# EAGLE design Linear-Temperature-Controller (EAGLE 6.5.0)

## Sheet 1 of 2
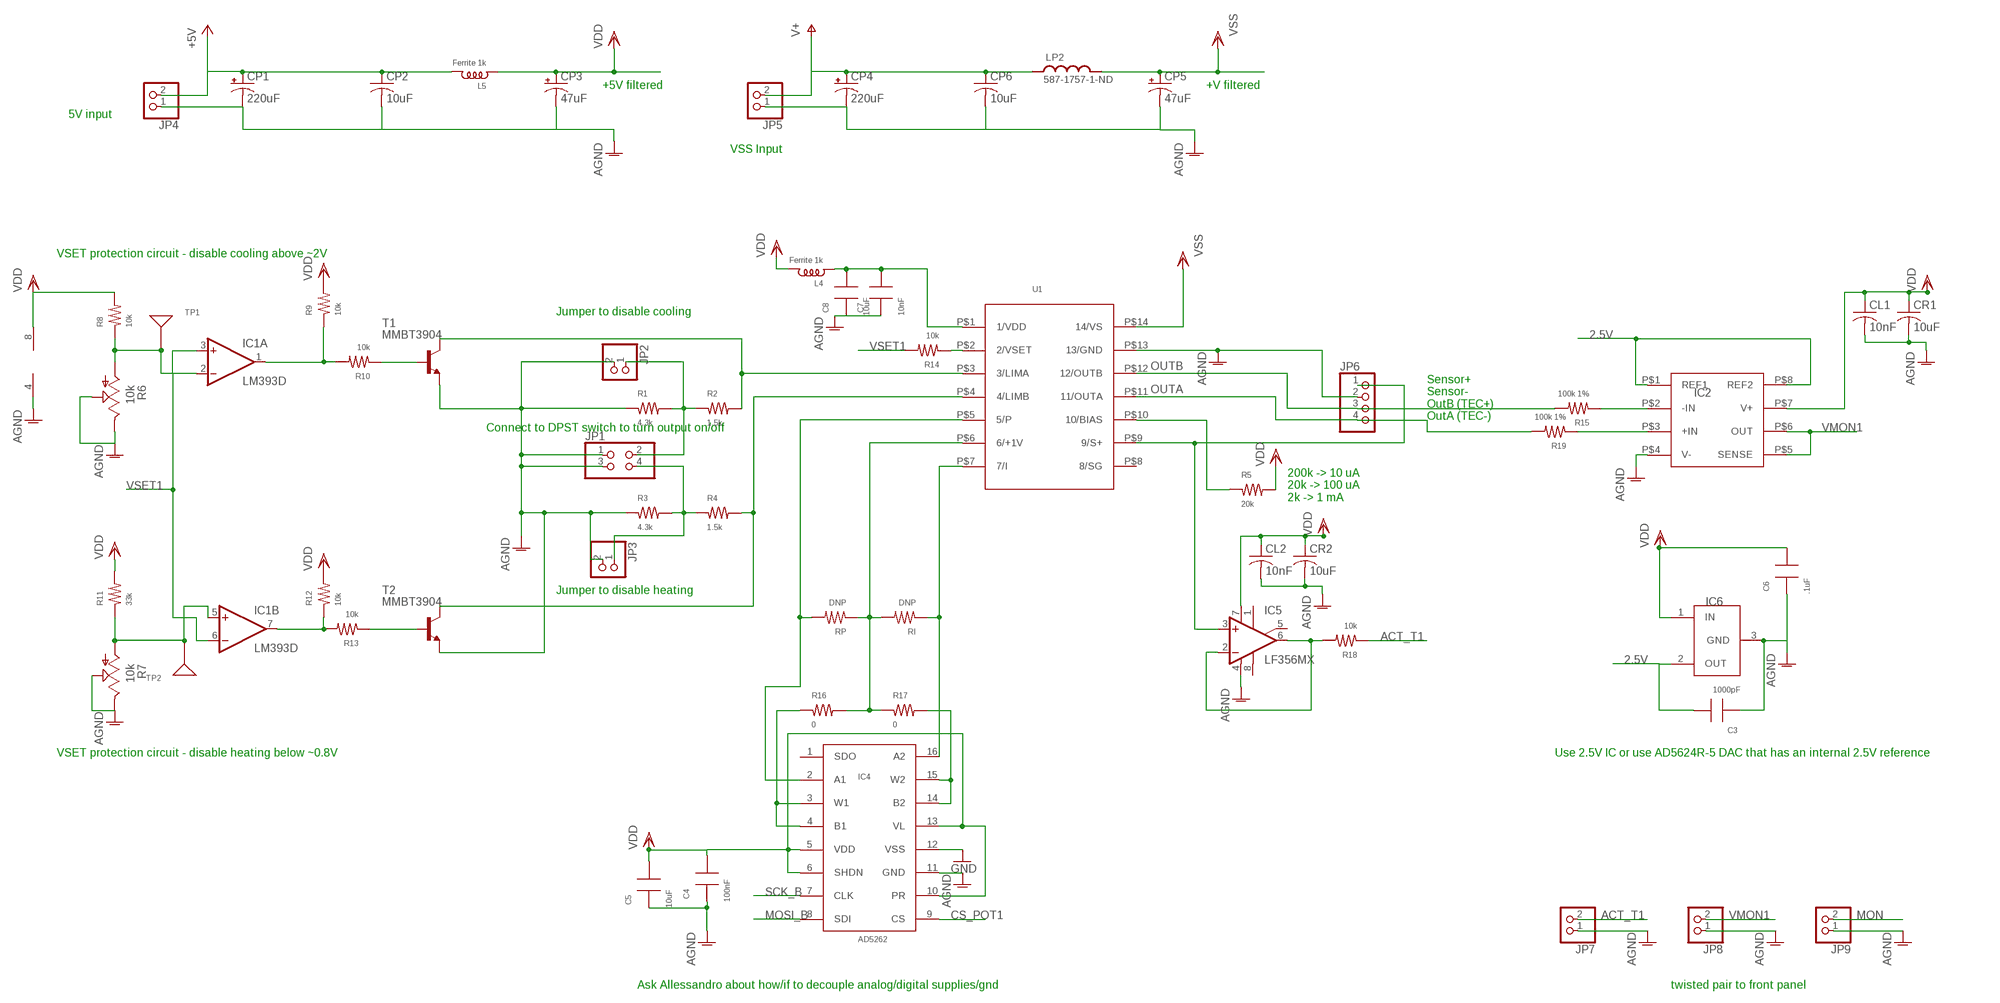
[diagram p0: schematic, sheet 1]

### Parts
C3  1000pF  CAP0805  [0805]
C4  100nF  CAP0805  [0805]
C5  10uF  CAP0805  [0805]
C6  .1uF  CAP0805  [0805]
C7  10nF  CAP0805  [0805]
C8  10uF  CAP0805  [0805]
CL1  10nF  C-USC0805  [C0805]
CL2  10nF  C-USC0805  [C0805]
CP1  220uF  CPOL-USF  [PANASONIC_F]
CP2  10uF  C-USC0805K  [C0805K]
CP3  47uF  CPOL-USCT7343  [CT7343]
CP4  220uF  CPOL-USF  [PANASONIC_F]
CP5  47uF  CPOL-USCT7343  [CT7343]
CP6  10uF  C-USC0805K  [C0805K]
CR1  10uF  C-USC0805  [C0805]
CR2  10uF  C-USC0805  [C0805]
IC1  LM393D  [SO08]
IC2  INA159  [VSSOP8]
IC4  AD5262  [TSSOP16]
IC5  LF356MX  OPAMP-SO  [SO08]
IC6  TS6001  [SOT-23]
JP1  PINHD-2X2  [2X02]
JP2  PINHD-1X2  [1X02]
JP3  PINHD-1X2  [1X02]
JP4  PINHD-1X2  [1X02]
JP5  PINHD-1X2  [1X02]
JP6  PINHD-1X4  [1X04]
JP7  PINHD-1X2  [1X02]
JP8  PINHD-1X2  [1X02]
JP9  PINHD-1X2  [1X02]
L4  Ferrite 1k  INDUCTOR-0805  [0805]
L5  Ferrite 1k  INDUCTOR-0805  [0805]
LP2  587-1757-1-ND  L_FERRITE_SMD  [L_FERRITE_1810]
R1  4.3k  RES0805  [0805]
R2  1.5k  RES0805  [0805]
R3  4.3k  RES0805  [0805]
R4  1.5k  RES0805  [0805]
R5  20k  RES0805  [0805]
R6  10k  64XR  [64XPOT]
R7  10k  64XR  [64XPOT]
R8  10k  RES0805  [0805]
R9  10k  RES0805  [0805]
R10  10k  RES0805  [0805]
R11  33k  RES0805  [0805]
R12  10k  RES0805  [0805]
R13  10k  RES0805  [0805]
R14  10k  RES0805  [0805]
R15  100k 1%  RES1206  [1206]
R16  0  RES0805  [0805]
R17  0  RES0805  [0805]
R18  10k  RES0805  [0805]
R19  100k 1%  RES1206  [1206]
RI  DNP  RES0805  [0805]
RP  DNP  RES0805  [0805]
T1  MMBT3904  [SOT-23]
T2  MMBT3904  [SOT-23]
TP1  TESTPT  [1206TESTPAD]
TP2  TESTPT  [1206TESTPAD]
U1  WTC3243  [WTC3293]

### Nets
2.5V: C3.2 IC2.P$1(REF1) IC2.P$8(REF2) IC6.2(OUT) ; also sheet 2
+5V: CP1.+ CP2.1 JP4.2 L5.2
ACT_T1: JP7.2 R18.1 ; also sheet 2
AGND: C3.1 C4.1 C5.1 C6.1 C7.1 C8.1 CL1.2 CL2.2 CP1.- CP2.2 CP3.- CP4.- CP5.- CP6.2 CR1.2 CR2.2 IC1.4(P:V-) IC2.P$4(V-) IC4.11(GND) IC5.4(V-) IC6.3(GND) JP1.1 JP1.3 JP2.2 JP3.2 JP4.1 JP5.1 JP6.2 JP7.1 JP8.1 JP9.1 R1.1 R3.1 R6.P$2 R6.P$3 R7.P$2 R7.P$3 T1.2(E) T2.2(E) U1.P$13(13/GND) ; also sheet 2
CS_POT1: IC4.9(CS) ; also sheet 2
DGND: IC4.12(VSS) ; supply symbol labelled GND ; also sheet 2
MON: JP9.2 ; also sheet 2
MOSI_B: IC4.8(SDI) ; also sheet 2
N$1: R2.2 T1.3(C) U1.P$3(3/LIMA)
N$2: JP1.2 JP2.1 R1.2 R2.1
N$3: R4.2 T2.3(C) U1.P$4(4/LIMB)
N$4: JP1.4 JP3.1 R3.2 R4.1
N$5: R5.1 U1.P$10(10/BIAS)
N$6: IC1.2(A:-IN) R6.P$1 R8.1 TP1.P$1
N$7: IC1.5(B:+IN) R7.P$1 R11.1 TP2.P$1
N$8: IC1.7(B:OUT) R12.1 R13.2
N$9: IC1.1(A:OUT) R9.1 R10.2
N$10: R10.1 T1.1(B)
N$11: R13.1 T2.1(B)
N$12: R14.1 U1.P$2(2/VSET)
N$13: IC5.3(+IN) JP6.1 U1.P$9(9/S+)
N$14: IC2.P$2(-IN) R15.1
N$15: IC4.2(A1) RP.2 U1.P$5(5/P)
N$16: IC2.P$3(+IN) R19.1
N$17: R16.2 R17.1 RI.2 RP.1 U1.P$6(6/+1V)
N$18: IC4.3(W1) IC4.4(B1) R16.1
N$19: IC4.16(A2) RI.1 U1.P$7(7/I)
N$20: IC4.14(B2) IC4.15(W2) R17.2
N$23: IC5.2(-IN) IC5.6(OUT) R18.2
N$26: C7.2 C8.2 L4.1 U1.P$1(1/VDD)
OUTA: JP6.4 R19.2 U1.P$11(11/OUTA)
OUTB: JP6.3 R15.2 U1.P$12(12/OUTB)
SCK_B: IC4.7(CLK) ; also sheet 2
V+: CP4.+ CP6.1 JP5.2 LP2.P$1
VDD: C4.2 C5.2 C6.2 CL1.1 CL2.1 CP3.+ CR1.1 CR2.1 IC1.8(P:V+) IC2.P$7(V+) IC4.5(VDD) IC4.6(SHDN) IC4.10(PR) IC4.13(VL) IC5.7(V+) IC6.1(IN) L4.2 L5.1 R5.2 R8.2 R9.2 R11.2 R12.2 ; also sheet 2
VMON1: IC2.P$5(SENSE) IC2.P$6(OUT) JP8.2 ; also sheet 2
VSET1: IC1.3(A:+IN) IC1.6(B:-IN) R14.2 ; also sheet 2
VSS: CP5.+ LP2.P$2 U1.P$14(14/VS)
Unconnected: IC4.1(SDO) IC5.1(ON1) IC5.5(ON2) IC5.8(OPT) U1.P$8(8/SG)

### Notes on the sheet
- +5V filtered | +V filtered
- 5V input
- VSS Input
- VSET protection circuit - disable cooling above ~2V
- Jumper to disable cooling
- Sensor+
  Sensor-
  OutB (TEC+)
  OutA (TEC-)
- Connect to DPST switch to turn output on/off
- 200k -> 10 uA
  20k -> 100 uA
  2k -> 1 mA
- Jumper to disable heating
- VSET protection circuit - disable heating below ~0.8V | Use 2.5V IC or use AD5624R-5 DAC that has an internal 2.5V reference
- Ask Allessandro about how/if to decouple analog/digital supplies/gnd | twisted pair to front panel

## Sheet 2 of 2
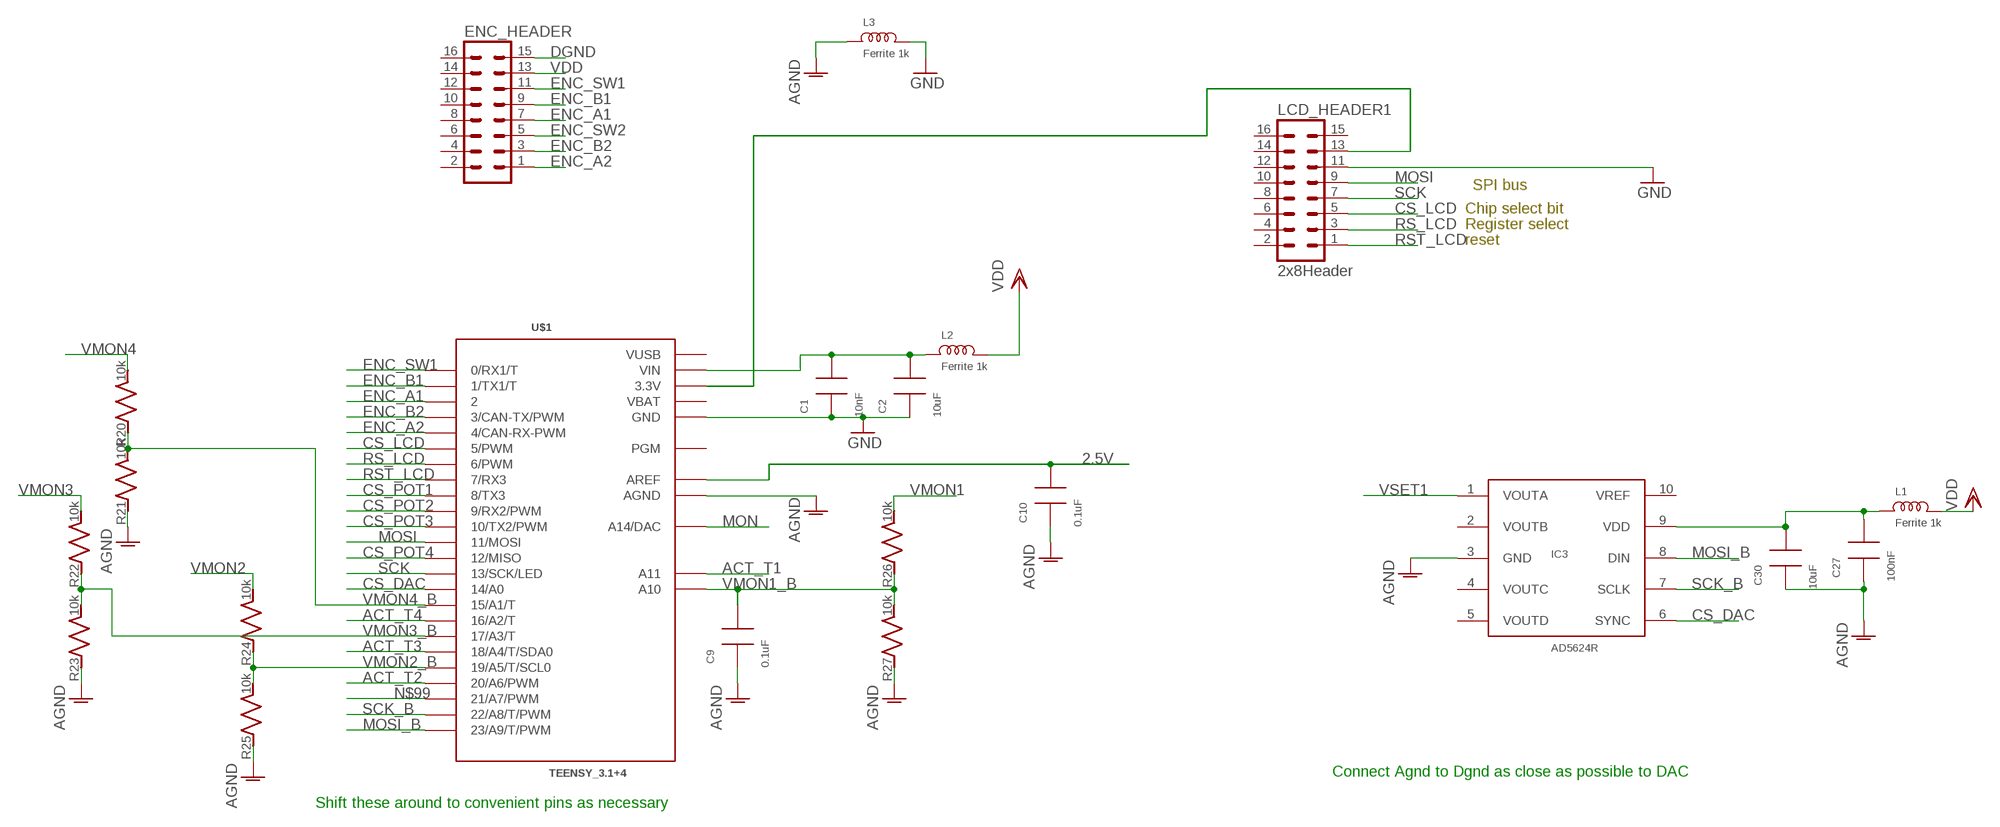
[diagram p1: schematic, sheet 2]

### Parts
C1  10nF  CAP0805  [0805]
C2  10uF  CAP0805  [0805]
C9  0.1uF  CAP0805  [0805]
C10  0.1uF  CAP0805  [0805]
C27  100nF  CAP0805  [0805]
C30  10uF  CAP0805  [0805]
ENC_HEADER  ML16  [ML16]
IC3  AD5624R  [MSOP10]
L1  Ferrite 1k  INDUCTOR-0805  [0805]
L2  Ferrite 1k  INDUCTOR-0805  [0805]
L3  Ferrite 1k  INDUCTOR-0805  [0805]
LCD_HEADER1  2x8Header  ML16  [ML16]
R20  10k  R_SMDR0805  [R_0805]
R21  10k  R_SMDR0805  [R_0805]
R22  10k  R_SMDR0805  [R_0805]
R23  10k  R_SMDR0805  [R_0805]
R24  10k  R_SMDR0805  [R_0805]
R25  10k  R_SMDR0805  [R_0805]
R26  10k  R_SMDR1206  [R_1206]
R27  10k  R_SMDR1206  [R_1206]
U$1  TEENSY_3.1+4  [TEENSY_3.1+4]

### Nets
2.5V: C10.2 U$1.AREF ; also sheet 1
ACT_T1: U$1.A11 ; also sheet 1
ACT_T2: U$1.20/A6(20/A6/PWM)
ACT_T3: U$1.18/A4(18/A4/T/SDA0)
ACT_T4: U$1.16/A2(16/A2/T)
AGND: C9.1 C10.1 C27.1 C30.1 IC3.3(GND) L3.1 R21.P$1 R23.P$1 R25.P$1 R27.P$1 U$1.AGND ; also sheet 1
CS_DAC: IC3.6(SYNC) U$1.14/A0
CS_LCD: LCD_HEADER1.5 U$1.5(5/PWM)
CS_POT1: U$1.8(8/TX3) ; also sheet 1
CS_POT2: U$1.9(9/RX2/PWM)
CS_POT3: U$1.10(10/TX2/PWM)
CS_POT4: U$1.12(12/MISO)
DGND: C1.1 C2.1 ENC_HEADER.15 L3.2 LCD_HEADER1.11 U$1.GND U$1.GND1(GND) ; supply symbol labelled GND ; also sheet 1
ENC_A1: ENC_HEADER.7 U$1.2
ENC_A2: ENC_HEADER.1 U$1.4(4/CAN-RX-PWM)
ENC_B1: ENC_HEADER.9 U$1.1(1/TX1/T)
ENC_B2: ENC_HEADER.3 U$1.3(3/CAN-TX/PWM)
ENC_SW1: ENC_HEADER.11 U$1.0(0/RX1/T)
ENC_SW2: ENC_HEADER.5
MON: U$1.A14(A14/DAC) ; also sheet 1
MOSI: LCD_HEADER1.9 U$1.11(11/MOSI)
MOSI_B: IC3.8(DIN) U$1.23/A9(23/A9/T/PWM) ; also sheet 1
N$21: LCD_HEADER1.13 U$1.3.3V U$1.3.3V1(3.3V)
N$24: C27.2 C30.2 IC3.9(VDD) L1.1
N$25: C1.2 C2.2 L2.1 U$1.VIN
N$99: U$1.21/A7(21/A7/PWM)
RS_LCD: LCD_HEADER1.3 U$1.6(6/PWM)
RST_LCD: LCD_HEADER1.1 U$1.7(7/RX3)
SCK: LCD_HEADER1.7 U$1.13(13/SCK/LED)
SCK_B: IC3.7(SCLK) U$1.22/A8(22/A8/T/PWM) ; also sheet 1
VDD: ENC_HEADER.13 L1.2 L2.2 ; also sheet 1
VMON1: R26.P$2 ; also sheet 1
VMON1_B: C9.2 R26.P$1 R27.P$2 U$1.A10
VMON2: R24.P$2
VMON2_B: R24.P$1 R25.P$2 U$1.19/A5(19/A5/T/SCL0)
VMON3: R22.P$2
VMON3_B: R22.P$1 R23.P$2 U$1.17/A3(17/A3/T)
VMON4: R20.P$2
VMON4_B: R20.P$1 R21.P$2 U$1.15/A1(15/A1/T)
VSET1: IC3.1(VOUTA) ; also sheet 1
Unconnected: ENC_HEADER.2 ENC_HEADER.4 ENC_HEADER.6 ENC_HEADER.8 ENC_HEADER.10 ENC_HEADER.12 ENC_HEADER.14 ENC_HEADER.16 IC3.2(VOUTB) IC3.4(VOUTC) IC3.5(VOUTD) IC3.10(VREF) LCD_HEADER1.2 LCD_HEADER1.4 LCD_HEADER1.6 LCD_HEADER1.8 LCD_HEADER1.10 LCD_HEADER1.12 LCD_HEADER1.14 LCD_HEADER1.15 LCD_HEADER1.16 U$1.PGM

### Notes on the sheet
- SPI bus
- Chip select bit
- Register select
- reset
- Connect Agnd to Dgnd as close as possible to DAC
- Shift these around to convenient pins as necessary

## Power pins joined to a net without a drawn wire
VBAT: U$1.VBAT
VUSB: U$1.VUSB

## Library data of the parts
C1-C10 C27 C30 = rlc-jqi:CAP: SMT Capacitor
CL1 CL2 CP2 CP6 CR1 CR2 = rcl:C-US: CAPACITOR, American symbol
CP1 CP3-CP5 = rcl:CPOL-US: POLARIZED CAPACITOR, American symbol
ENC_HEADER = aom_driver:ML16: HARTING 2x8 (16 pin) ribbon connector.; OC_FARNELL: unknown; OC_NEWARK: unknown
IC1 = Lin-Temp-Controller:LM393: COMPARATOR
IC2 = Lin-Temp-Controller:INA159: INA159 Difference Amplifier, Texas Instruments; DIGIKEY: 296-18688-1-ND
IC3 = Lin-Temp-Controller:AD5624R: AD5624R Quad Output DAC w/internal Vref; DIGIKEY: AD5624RBRMZ-3-ND
IC4 = Lin-Temp-Controller:AD5262: AD5262 dual circuit digital pot
IC5 = opamp-jqi:OPAMP: Basic Op Amp. Be sure to check actual pinout of your device, and modify as necessary!
IC6 = Lin-Temp-Controller:TS6001: 2.5V Reference IC; DIGIKEY: TS6001BIG325TCT-ND
JP1 = pinhead:PINHD-2X2: PIN HEADER
JP2-JP5 JP7-JP9 = pinhead:PINHD-1X2: PIN HEADER
JP6 = pinhead:PINHD-1X4: PIN HEADER
L1-L5 = rlc-jqi:INDUCTOR: SMT Inductor.
LCD_HEADER1 = mcu-accessories:ML16: HARTING 2x8 (16 pin) ribbon connector.; OC_FARNELL: unknown; OC_NEWARK: unknown; PARTNO: S9171-ND
LP2 = jqi_passives:L_FERRITE_SMD
R1-R5 R8-R19 RI RP = rlc-jqi:RES: SMT Resistor
R6 R7 = Lin-Temp-Controller:64XR; DIGIKEY: 987-1068-ND
R20-R27 = jqi_passives:R_SMD
T1 T2 = Lin-Temp-Controller:MMBT3904: NPN TRANSISTOR
TP1 TP2 = Lin-Temp-Controller:TESTPT
U1 = Lin-Temp-Controller:WTC3243
U$1 = mcu-accessories:TEENSY_3.1+4: Footprint for Teensy 3.1 board using all through-holes, i.e. the entire perimeter plus the 4 through-holes inboard (A10,A11,AREF, VUSB)

## Board
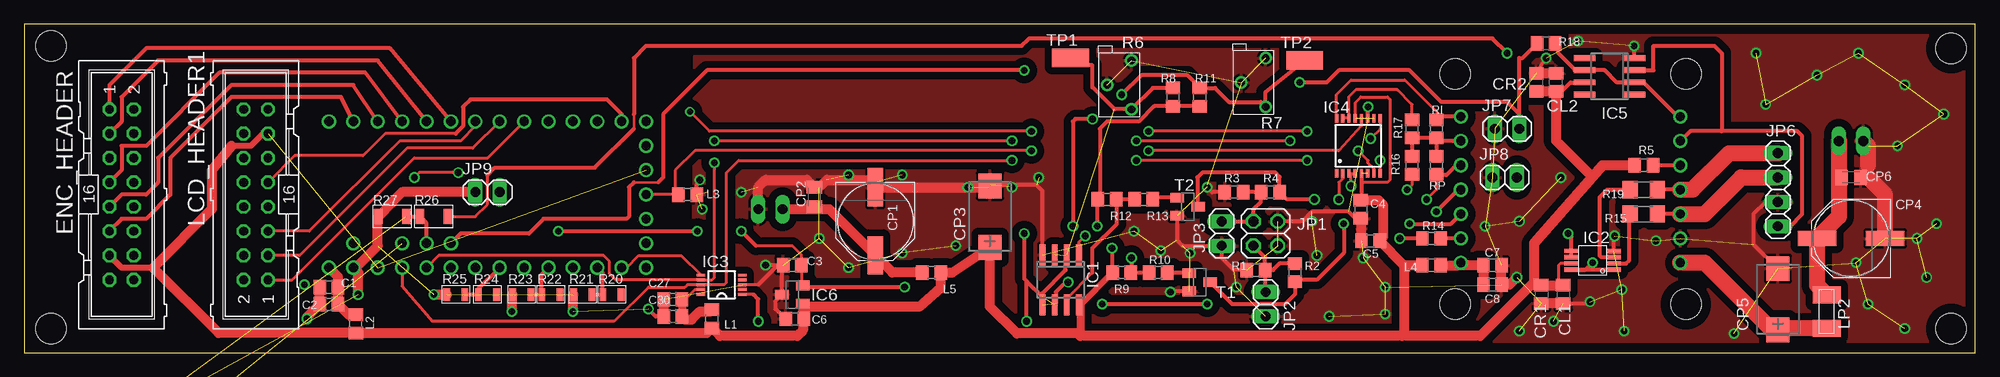
[diagram p2: board, top side]
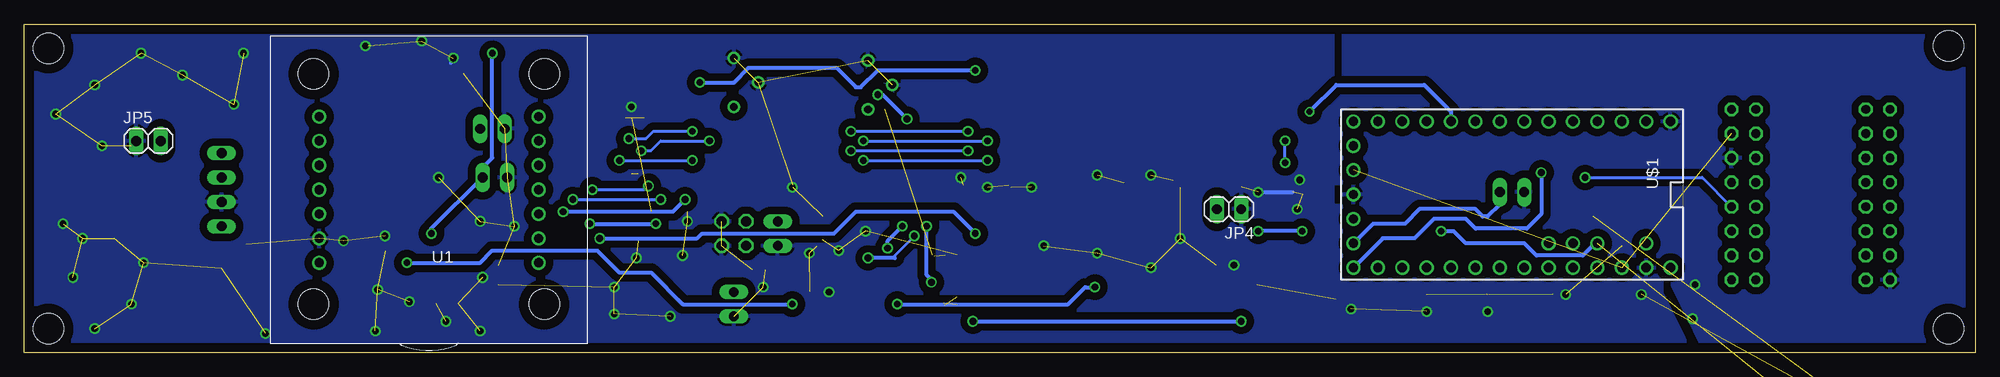
[diagram p3: board, bottom side, seen from below]

Size 203.2 x 34.29 mm. Coordinates in mm from the lower left corner, seen from the top.
Outline: 0,0 203.2,0 203.2,34.29 0,34.29 0,0
Copper layers (1*16): Top 0.035mm / dielectric 1.5mm / Bottom 0.035mm
Design rules "default": minimum track width 10mil, minimum drill 24mil, track to track 8mil, track to pad 8mil, pad to pad 8mil, via to via 8mil, smd to smd 8mil, copper to edge 40mil, drill to drill 8mil, minimum pad ring 10mil, minimum via ring 8mil, stop-mask expansion 4mil, vias tented up to drill 0mil, thermal gap 10mil
Holes 3.17 mm at 200.66,31.75 200.66,2.54 2.79,32 2.79,2.54

### Footprints (pad centres in the part's own frame; a part is rotated, then mirrored left to right if it is on the bottom)
0805 = smd 1.3 x 1.5: 1 -0.95,0; 2 0.95,0
C0805 = smd 1.3 x 1.5: 1 -0.95,0; 2 0.95,0
PANASONIC_F = smd 4 x 1.6: + 3.55,0; - -3.55,0
C0805K = smd 1.3 x 1.6: 1 -1,0; 2 1,0
CT7343 = smd 2.6 x 2.4: + -3.2,0; - 3.2,0
ML16 = drill 0.914 octagon: 1 -8.89,-1.27; 2 -8.89,1.27; 3 -6.35,-1.27; 4 -6.35,1.27; 5 -3.81,-1.27; 6 -3.81,1.27; 7 -1.27,-1.27; 8 -1.27,1.27; 9 1.27,-1.27; 10 1.27,1.27; 11 3.81,-1.27; 12 3.81,1.27; 13 6.35,-1.27; 14 6.35,1.27; 15 8.89,-1.27; 16 8.89,1.27
SO08 = smd 0.6 x 2.2: 1 -1.905,-2.6; 2 -0.635,-2.6; 3 0.635,-2.6; 4 1.905,-2.6; 5 1.905,2.6; 6 0.635,2.6; 7 -0.635,2.6; 8 -1.905,2.6
VSSOP8 = smd 0.45 x 1.45: P$1 -0.975,-2.2; P$2 -0.325,-2.2; P$3 0.325,-2.2; P$4 0.972,-2.2; P$5 0.975,2.2; P$6 0.325,2.2; P$7 -0.325,2.2; P$8 -0.975,2.2
MSOP10 = smd 0.9 x 0.3: 1 -2.16,1; 2 -2.16,0.5; 3 -2.16,0; 4 -2.16,-0.5; 5 -2.16,-1; 6 2.16,-1; 7 2.16,-0.5; 8 2.16,0; 9 2.16,0.5; 10 2.16,1
TSSOP16 = smd 0.9 x 0.35: 1 -2.875,2.275; 2 -2.875,1.625; 3 -2.875,0.975; 4 -2.875,0.325; 5 -2.875,-0.325; 6 -2.875,-0.975; 7 -2.875,-1.625; 8 -2.875,-2.275; 9 2.875,-2.275; 10 2.875,-1.625; 11 2.875,-0.975; 12 2.875,-0.325; 13 2.875,0.325; 14 2.875,0.975; 15 2.875,1.625; 16 2.875,2.275
SO08' = smd 2.2 x 0.6: 1 -2.6,1.27; 2 -2.6,0; 3 -2.6,-1.27; 4 -2.6,-2.54; 5 2.6,-2.54; 6 2.6,-1.27; 7 2.6,0; 8 2.6,1.27
SOT-23 = smd 1 x 1.4: 1 -0.95,-1.1; 2 0.95,-1.1; 3 0,1.1
2X02 = drill 1.016 octagon: 1 -1.27,-1.27; 2 -1.27,1.27; 3 1.27,-1.27; 4 1.27,1.27
1X02 = drill 1.016 long: 1 -1.27,0; 2 1.27,0
1X04 = drill 1.016 long: 1 -3.81,0; 2 -1.27,0; 3 1.27,0; 4 3.81,0
L_FERRITE_1810 = smd 1.75 x 2.9: P$1 -1.75,0; P$2 1.75,0
64XPOT = drill 0.8: P$1 -1.27,2.54; P$2 1.27,0; P$3 -1.27,-2.54
1206 = smd 1.6 x 1.803: 1 -1.422,0; 2 1.422,0
R_0805 = smd 0.7 x 1.3: P$1 -0.95,0; P$2 0.95,0
R_1206 = smd 0.9 x 1.6: P$1 -1.45,0; P$2 1.45,0
1206TESTPAD = smd 3.81 x 1.93: P$1 0,0
WTC3293 = drill 0.965: P$1 -11.43,7.62; P$2 -11.43,5.08; P$3 -11.43,2.54; P$4 -11.43,0; P$5 -11.43,-2.54; P$6 -11.43,-5.08; P$7 -11.43,-7.62; P$8 11.43,-7.62; P$9 11.43,-5.08; P$10 11.43,-2.54; P$11 11.43,0; P$12 11.43,2.54; P$13 11.43,5.08; P$14 11.43,7.62 | hole 3.175: -12.014,11.938; 12.014,11.938; 12.014,-12.065; -12.014,-12.065
TEENSY_3.1+4 = drill 0.965: 0 -7.62,15.24; 1 -7.62,12.7; 2 -7.62,10.16; 3 -7.62,7.62; 3.3V 7.62,12.7; 3.3V1 -2.54,-15.24; 4 -7.62,5.08; 5 -7.62,2.54; 6 -7.62,0; 7 -7.62,-2.54; 8 -7.62,-5.08; 9 -7.62,-7.62; 10 -7.62,-10.16; 11 -7.62,-12.7; 12 -7.62,-15.24; 13 7.62,-15.24; 14/A0 7.62,-12.7; 15/A1 7.62,-10.16; 16/A2 7.62,-7.62; 17/A3 7.62,-5.08; 18/A4 7.62,-2.54; 19/A5 7.62,0; 20/A6 7.62,2.54; 21/A7 7.62,5.08; 22/A8 7.62,7.62; 23/A9 7.62,10.16; A10 5.08,7.62; A11 5.08,5.08; A14 5.08,-15.24; AGND 7.62,15.24; AREF 5.08,10.16; GND -7.62,17.78; GND1 0,-15.24; PGM 2.54,-15.24; VBAT -5.08,-15.24; VIN 7.62,17.78; VUSB 5.08,15.24

### Placement (x,y rotation side)
C1  31.75,6.86 0 top
C2  31.75,5.08 0 top
C3  80.01,9.14 0 top
C4  139.19,14.99 90 top
C5  140.21,11.68 0 top
C6  80.26,3.56 0 top
C7  152.91,9.14 180 top
C8  152.91,7.11 180 top
C9  3.81,-11.43 0 top  (outside the outline)
C10  3.81,-16.51 0 top  (outside the outline)
C27  67.56,5.59 0 top
C30  67.56,3.81 0 top
CL1  160.27,6.1 270 top
CL2  159.51,28.19 90 top
CP1  88.65,13.72 270 top
CP2  82.3,16.26 90 top
CP3  100.58,14.22 90 top
CP4  190.25,11.94 180 top
CP5  182.63,5.59 90 top
CP6  190.25,18.29 0 top
CR1  157.99,6.1 270 top
CR2  157.48,28.19 90 top
ENC_HEADER  10.16,16.51 270 top
IC1  107.95,7.62 180 top
IC2  163.32,9.65 90 top
IC3  72.64,7.11 180 top
IC4  138.94,21.59 90 top
IC5  LF356MX  [SO08']  165.1,28.19 180 top
IC6  80.01,6.1 90 top
JP1  129.29,12.45 90 top
JP2  129.29,5.08 270 top
JP3  124.71,12.45 270 top
JP4  77.72,14.99 180 bottom
JP5  190.25,22.1 0 bottom
JP6  182.63,17.02 90 top
JP7  154.43,23.37 0 top
JP8  154.18,18.29 0 top
JP9  48.26,16.76 0 top
L1  71.63,3.56 270 top
L2  34.54,3.05 270 top
L3  69.09,16.51 180 top
L4  146.56,9.14 180 top
L5  94.49,8.38 180 top
LCD_HEADER1  24.13,16.51 90 top
LP2  187.71,4.32 270 top
R1  128.27,8.64 0 top
R2  132.33,8.38 270 top
R3  125.98,16.76 0 top
R4  129.79,16.76 0 top
R5  168.66,19.56 180 top
R6  114.05,27.94 180 top
R7  128.02,28.19 180 top
R8  119.63,26.67 270 top
R9  114.3,8.38 180 top
R10  118.11,8.38 180 top
R11  122.43,26.67 270 top
R12  112.78,16 180 top
R13  116.59,16 180 top
R14  146.56,11.94 180 top
R15  168.66,14.48 0 top
R16  144.53,19.56 90 top
R17  144.53,23.37 90 top
R18  158.5,32.26 0 top
R19  168.66,17.02 0 top
R20  61.21,6.1 0 top
R21  58.17,6.1 0 top
R22  54.86,6.1 0 top
R23  51.82,6.1 0 top
R24  48.26,6.1 0 top
R25  44.96,6.1 0 top
R26  42.67,14.22 0 top
R27  38.35,14.22 0 top
RI  147.07,23.37 270 top
RP  147.07,19.56 270 top
T1  122.43,7.37 270 top
T2  121.16,15.24 270 top
TP1  108.97,30.73 0 top
TP2  133.35,30.48 0 top
U1  161.04,17.02 180 bottom
U$1  49.53,16.51 270 bottom

### Tracks (layer width: path | path; a pad name or v marks a point on that pad's centre or on a via)
2.5V  (via drill 0.7)  (1 unrouted)
  Top 0.305: IC6.2 81.09,7.05 81.03,7.11 81.03,9.08 C3.2 80.96,10.23 80.01,11.18 76.2,11.18
  Top 0.406: IC2.P$1 IC2.P$8 162.6,8.68 v163.32,9.4 | v123.19,5.08 v112.27,5.08 | v91.69,6.86 81.3,6.86 IC6.2 | v55.63,12.7 v70.1,12.7 | v74.68,12.7 76.2,11.18
  Bottom 0.406: v163.32,9.4 155.7,9.4 154.43,10.67 143.51,10.67 141.22,8.38 137.92,8.38 134.62,5.08 v123.19,5.08 | v112.27,5.08 94.49,5.08 92.71,6.86 v91.69,6.86 | U$1.AREF 39.62,11.43 40.89,10.16 45.72,10.16 46.99,11.43 53.09,11.43 54.36,12.7 v55.63,12.7 | v70.1,12.7 v74.68,12.7
+5V
  Top 1.016: JP4.2 82.28,14.99 | 82.28,14.99 CP2.1 | 82.28,14.99 83.83,14.99 CP1.+ 90.43,8.38 L5.2
ACT_T1  (via drill 0.7)
  Top 0.279: 63.5,17.78 66.04,17.78
  Top 0.406: v132.84,28.19 135.64,28.19 136.91,29.46 144.27,29.46 147.57,26.16 154.43,26.16 155.7,24.89 JP7.2 155.7,30.73 156.02,30.73 R18.1 | v104.14,29.46 71.12,29.46 66.55,24.89 66.55,18.29 66.04,17.78 | U$1.A11 45.47,12.45 52.58,12.45 54.1,13.97 62.74,13.97 62.99,14.22 62.99,17.27 63.5,17.78
  Bottom 0.406: v132.84,28.19 129.29,28.19 127.76,29.72 118.62,29.72 116.59,27.69 116.08,27.69 114.3,29.46 v104.14,29.46
AGND  (via drill 0.7)  (74 unrouted)
  Top 0.305: 76.45,7.11 IC3.3
  Top 0.406: JP6.2 181.36,15.75 180.09,14.48 180.09,11.33 CP5.- | 192.28,18.03 191.75,18.03 CP6.2 191.25,18.78 192.02,19.56 | IC4.11 139.91,25.61 v139.95,25.65 | IC2.P$4 165.52,12.11 v165.61,12.19 | CL1.2 162.88,5.15 v163.07,5.33 | C8.1 154.69,7.11 | IC5.4 167.7,31.94 v167.64,32 | CR2.2 157.48,29.21 v158.5,30.73 | JP1.3 133.1,13.72 134.11,14.73 137.92,14.73 138.62,14.04 C4.1 139.26,13.97 | R1.1 125.98,8.64 124.71,9.91 JP3.2 120.65,11.18 120.06,11.77 T2.2 | T1.2 119.45,6.42 v119.38,6.35 | R3.1 123.7,16.76 v123.19,17.27 | IC1.4 106.05,16.89 105.41,17.53 100.69,17.53 CP3.- | L3.1 70.04,17.46 v70.36,18.03 | C6.1 79.25,3.56 78.23,4.57 78.23,5.42 IC6.3 78.91,8.99 C3.1 78.49,9.14 | 78.49,9.14 76.45,7.11 | 78.49,9.14 v77.22,9.14 | C30.1 65.79,3.81 v65.02,4.57
  Top 1.016: v34.8,6.1 34.8,8.38 U$1.AGND 34.54,8.89 36.83,11.18 36.83,14.15 R27.P$1 38.35,15.67 38.35,15.75 39.37,16.76 JP9.1 | v42.67,6.1 R25.P$1 | v50.8,4.32 50.8,6.03 R23.P$1 | v57.15,4.32 57.15,6.03 R21.P$1 | CL1.2 CR1.2 | C8.1 C7.1 | 154.69,7.11 v155.45,7.87 | CR2.2 CL2.2 | C5.1 139.26,13.97 | JP4.1 76.45,17.27 77.22,18.03 81.52,18.03 CP2.2 82.79,17.26 83.57,18.03 88.39,18.03 88.65,17.78 CP1.- 100.43,17.27 CP3.- | C27.1 C30.1
  Top 1.676: CP4.- 193.8,16.52 192.28,18.03 | 192.02,19.56 192.02,21.59 JP5.1
  Bottom 0.406: v163.07,5.33 163.07,5.08 | v155.45,7.87 155.45,8.13 | v167.64,32 167.39,32 | v158.5,30.73 158.75,30.23 | v119.38,6.35 119.13,6.35 | v123.19,17.27 123.19,17.53 | v74.68,16.76 71.12,16.76 | v70.36,18.03 70.61,18.03 | v77.22,9.14 76.96,8.89 | v65.02,4.57 65.02,4.83
  other vias: 70.61,14.99 85.85,18.54 91.44,18.54 98.3,17.27 102.87,17.27 105.66,18.29 97.03,11.18 91.44,10.41 85.85,8.89 82.8,11.94 115.57,12.7 118.36,10.67 121.41,10.41 126.24,6.86 134.62,10.16 134.11,13.72 141.73,6.86 135.89,3.81 141.73,4.06 139.45,9.91 152.15,13.21 155.7,13.72 160.02,18.29 169.93,11.68 166.37,6.6 166.62,2.29 178.05,2.03 155.7,2.29 159.26,3.3 181.36,25.91 180.34,31.24 191.01,31.24 186.69,28.96 195.83,27.94 195.07,21.59 199.9,24.89 199.14,13.46 197.1,11.94 190.75,9.4 192.02,5.08 198.12,7.87 195.83,2.54 161.8,32.51
  pour Bottom (isolate 0.762, rank 2): 27.94,34.04 203.71,34.29 203.71,0 28.19,-0.25
  pour Top (isolate 0.762): 69.85,34.54 204.22,34.8 204.22,-1.27 69.85,-1.27 69.6,-1.02
CS_DAC
  Top 0.305: U$1.14/A0 62.74,8.89 64.01,10.16 68.44,10.16 IC3.6
CS_LCD
  Top 0.305: U$1.5 46.99,23.62 45.47,22.1 39.12,22.1 29.72,12.7 LCD_HEADER1.5
CS_POT1  (via drill 0.6, 0.7)
  Top 0.305: IC4.9 141.21,23.36 v140.21,22.35 | v133.6,23.11 v117.09,23.11 | v104.9,23.11 71.37,23.11 v69.34,25.15
  Bottom 0.305: v140.21,22.35 138.43,22.35 137.67,23.11 v133.6,23.11 | v117.09,23.11 v104.9,23.11
  Bottom 0.406: U$1.8 54.61,25.15 57.4,27.94 66.55,27.94 v69.34,25.15
DGND  (via drill 0.7)
  Top 0.305: U$1.GND1 L3.2 67.82,16.83 67.82,19.05 69.85,21.08 v104.9,21.08 | IC4.12 139.26,23.69 136.91,21.08 v117.09,21.08
  Top 1.016: C1.1 C2.1 29.46,3.74 v29.46,3.56
  Bottom 0.305: v117.09,21.08 v104.9,21.08
  other vias: 29.21,7.11
  pour Bottom (isolate 0.762): 0,34.29 0,-0.25 27.94,-0.25 31.75,7.62 65.79,7.62 65.79,34.29
ENC_A1
  Top 0.406: U$1.2 35.56,29.21 20.32,29.21 12.7,21.59 10.16,21.59 10.16,19.05 ENC_HEADER.7
ENC_A2
  Top 0.406: U$1.4 38.1,31.75 12.7,31.75 8.89,27.94 ENC_HEADER.1
ENC_B1
  Top 0.406: U$1.1 34.29,27.94 21.59,27.94 13.97,20.32 13.97,17.78 12.7,16.51 10.16,16.51 ENC_HEADER.9
ENC_B2
  Top 0.406: U$1.3 36.83,30.48 13.97,30.48 10.16,26.67 10.16,24.13 ENC_HEADER.3
ENC_SW1
  Top 0.406: U$1.0 33.02,26.67 21.59,26.67 15.24,20.32 15.24,16.51 12.7,13.97 10.16,13.97 ENC_HEADER.11
MON
  Bottom 0.406: JP9.2 49.53,15.49 50.8,14.22 51.31,14.22 52.07,14.99 57.91,14.99 59.44,13.46 62.74,13.46 U$1.A14
MOSI
  Top 0.305: 44.96,22.86 37.59,22.86 35.31,20.57 28.19,20.57 LCD_HEADER1.9
  Top 0.406: U$1.11 62.23,24.89 60.71,26.42 46.48,26.42 45.72,25.65 45.72,23.62 44.96,22.86
MOSI_B  (via drill 0.7)
  Top 0.305: U$1.23/A9 39.37,6.99 42.55,3.3 61.47,3.3 65.02,6.86 68.83,6.86 69.09,7.11 IC3.8 72.9,7.11 73.15,7.37 73.15,18.8 74.42,20.07 v102.87,20.07 | IC4.8 141.21,20.05 v141.22,20.07 | v133.6,20.07 v115.82,20.07
  Bottom 0.305: v141.22,20.07 v133.6,20.07 | v115.82,20.07 v102.87,20.07
N$1  (via drill 0.7)
  Top 0.406: v144.27,13.46 148.59,13.46 U1.P$3 | T1.3 125.81,5.08 131.32,5.08 132.33,6.1 R2.2 132.52,7.62 134.62,7.62 137.41,10.41 v137.41,13.46
  Bottom 0.406: v144.27,13.46 v137.41,13.46
N$2
  Top 0.406: R2.1 130.74,9.33 130.05,8.64 R1.2 | R1.2 129.22,9.97 JP1.2 | R1.2 129.22,6.42 JP2.1
N$3  (via drill 0.7)
  Top 0.305: U1.P$4 149.35,17.02
  Top 0.406: 149.35,17.02 v147.07,14.73 | v134.37,16 131.51,16 R4.2 130.74,18.35 130.3,18.8 122.68,18.8 122.17,18.29 122.17,15.32 T2.3
  Bottom 0.406: v147.07,14.73 135.64,14.73 v134.37,16
N$4
  Top 0.305: R4.1 128.78,16.76
  Top 0.406: R3.2 R4.1 128.78,16.7 128.78,15.75 128.02,14.99 JP1.4 JP3.1
N$5
  Top 0.406: U1.P$10 R5.1
N$6  (1 unrouted)
  Top 0.406: R8.1 117.54,27.62 R6.P$1 113.54,25.4 111.25,27.69 111.25,29.97 109.47,29.97 TP1.P$1 108.71,30.48 107.44,30.48 107.31,30.35
N$7  (via drill 0.7)  (1 unrouted)
  Top 0.406: TP2.P$1 129.29,27.18 R7.P$1 128.78,26.16 125.48,26.16 124.02,27.62 R11.1 122.43,27.69 121.16,28.96 116.33,28.96 v114.3,26.92 | v111.25,24.38 109.47,24.38 109.22,24.13 v109.22,13.21 | v108.71,7.37 108.46,7.37 107.44,6.35 107.44,5.15
  Bottom 0.406: v114.3,26.92 113.79,26.92 v111.25,24.38 | v108.71,7.37 108.71,7.62 109.22,8.13 v109.22,13.21
N$8
  Top 0.305: 108.58,5.71 111.25,8.38
  Top 0.406: R13.2 R12.1 113.79,15.94 113.79,13.46 111.25,10.92 111.25,8.38 | IC1.7 108.58,5.71
N$9  (via drill 0.7)
  Top 0.305: 109.86,11.3 109.86,11.56 v110.49,12.19
  Top 0.406: R10.2 R9.1 115.32,8.45 v115.32,9.91 | IC1.1 109.86,11.3
  Bottom 0.305: 112.52,9.91 112.52,10.16 v110.49,12.19
  Bottom 0.406: 112.52,9.91 v115.32,9.91
N$10
  Top 0.406: R10.1 121.26,8.38 T1.1
N$11
  Top 0.406: T2.1 117.72,16.19 R13.1
N$12
  Top 0.406: U1.P$2 R14.1
N$13
  Top 0.406: JP6.1 183.9,13.21 185.17,14.48 185.17,22.61 184.66,23.11 176.78,23.11 | 176.78,23.11 173.48,23.11 U1.P$9 | IC5.3 169.67,29.46 169.67,32 176.02,32 176.78,31.24 176.78,23.11
N$14
  Top 0.406: IC2.P$2 166.81,9.33 167.13,9.65 167.13,14.38 R15.1
N$15  (via drill 0.7)
  Top 0.305: RP.2 147.07,17.02 v146.05,16 | IC4.2 137.31,18.14 137.26,18.14 136.91,17.78 v136.91,16
  Top 0.406: U1.P$5 149.1,19.56 148.08,18.54 147.13,18.54 RP.2
  Bottom 0.305: v146.05,16 v136.91,16
N$16
  Top 0.406: IC2.P$3 164.27,9.98 164.08,10.16 164.08,16.26 164.85,17.02 R19.1
N$17
  Top 0.406: U1.P$6 147.07,22.1 | 147.07,22.1 RI.2 R17.1 R16.2 | 147.07,22.1 RP.1
N$18  (via drill 0.7)
  Top 0.305: IC4.4 IC4.3 138.18,18.5 v138.18,17.4 | R16.1 144.53,17.53 v144.02,17.02
  Bottom 0.305: v144.02,17.02 138.68,17.02 138.3,17.4 v138.18,17.4
N$19
  Top 0.305: IC4.16 136.66,26.93 138.18,28.45 143.76,28.45 147.57,24.64
  Top 0.406: U1.P$7 147.57,24.64 147.07,24.64 RI.1
N$20
  Top 0.305: IC4.15 IC4.14 137.92,24.51 137.92,26.67 138.68,27.43 143,27.43 144.53,25.91 R17.2
N$21  (2 unrouted)
N$23
  Top 0.406: 172.21,24.64 168.66,28.19 IC5.2 165.86,28.19 164.59,29.46 IC5.6 161.48,29.46 161.48,29.53 159.77,31.24 159.77,31.94 R18.2
N$24
  Top 0.305: 68.83,3.49 C30.2 | C27.2 69.09,5.84 69.85,6.6 IC3.9
  Top 0.813: C27.2 C30.2
  Top 1.016: 68.83,3.49 69.53,3.49 70.36,4.32 71.44,4.32 L1.1
N$25
  Top 1.016: U$1.VIN 32.7,7.94 C1.2 C2.2 33.78,4 L2.1
N$26
  Top 1.016: L4.1 149.35,9.14 U1.P$1 149.86,9.14 C7.2 C8.2
OUTA
  Top 0.406: U1.P$11 R19.2
  Top 1.676: U1.P$11 173.74,17.02 177.55,20.83 JP6.4
OUTB
  Top 0.406: U1.P$12 R15.2
  Top 1.676: U1.P$12 175.01,14.48 178.82,18.29 JP6.3
RS_LCD
  Top 0.305: U$1.6 46.74,21.34 39.88,21.34 28.7,10.16 LCD_HEADER1.3
RST_LCD
  Top 0.305: LCD_HEADER1.1 27.94,7.62 40.64,20.32 48.26,20.32 U$1.7
SCK  (via drill 0.7)
  Top 0.305: v45.21,18.8 41.15,18.8 v40.64,18.29
  Bottom 0.305: v40.64,18.29 28.45,18.29 LCD_HEADER1.7
  Bottom 0.406: v45.21,18.8 45.21,14.48 46.74,12.95 52.07,12.95 53.09,13.97 56.39,13.97 58.42,11.94 61.72,11.94 U$1.13
SCK_B  (via drill 0.7)
  Top 0.305: U$1.22/A8 43.18,10.16 60.33,10.16 60.96,9.53 60.96,8.26 61.6,7.61 IC3.7 71.62,7.61 71.88,7.87 v71.88,19.81 | IC4.7 140.56,19.2 139.95,19.81 139.95,20.07 v138.94,21.08 | v131.83,22.1 v115.82,22.1 | v102.87,22.1 v71.88,22.1
  Bottom 0.305: v138.94,21.08 137.92,21.08 136.91,22.1 v131.83,22.1 | v115.82,22.1 v102.87,22.1 | v71.88,19.81 v71.88,22.1
V+
  Top 0.406: CP6.1 188.98,18.29 JP5.2
  Top 1.676: JP5.2 188.98,14.22 CP4.+ 186.7,7.08 LP2.P$1
VDD  (via drill 0.7)  (2 unrouted)
  Top 0.305: IC1.8 109.99,5.02 | IC2.P$7 159.95,9.33 159.77,9.14 159.77,7.55 CL1.1 | 139.26,17.53 139.52,17.78 141.99,17.78 142.24,18.03 142.24,26.42 141.99,26.67 139.19,26.67 138.61,26.09 IC4.13
  Top 0.406: CL2.1 160.09,27.24 161.04,28.19 IC5.7 | IC4.5 139.26,17.53 139.26,16.01 C4.2 | 109.99,2.04 109.98,2.03 | R11.2 R8.2 117.67,25.72 116.08,24.13 112.78,24.13 112.01,23.37 112.01,16.19 R12.2 111.76,15.94 v111.76,13.21 | R9.2 113.35,10.86 v113.28,10.92
  Top 0.61: 13.46,8.89 10.16,8.89 ENC_HEADER.13 | 24.89,22.86 23.62,21.59 21.59,21.59 | 109.99,5.02 R9.2
  Top 0.813: 109.99,5.02 109.99,2.04
  Top 1.016: 21.59,21.59 19.56,19.05 19.56,14.99 13.46,8.89 20.25,2.1 L2.2 71.12,2.1 L1.2 72.46,1.78 80.52,1.78 81.11,2.37 81.11,3.66 | CP3.+ 96.67,8.38 L5.1 95.44,6.79 93.22,4.83 81.43,4.83 IC6.1 81.11,3.66 | 81.11,3.66 C6.2 | CP3.+ 101.24,11.02 | 157.48,7.05 CR1.1 CL1.1 | 157.48,7.05 156.91,7.05 151.64,1.78 143.51,1.78 | R5.2 164.34,19.56 163.28,18.35 | 163.28,18.35 157.23,11.43 157.23,7.3 157.48,7.05 | 163.28,18.35 159.51,22.12 CL2.1 CR2.1 | 143.7,9.14 C5.2 141.48,12 141.48,15.49 141.04,15.94 C4.2 | 109.98,2.03 109.73,2.03 | 109.73,2.03 103.38,2.03 100.58,4.83 CP3.+ | 143.51,1.78 109.98,1.78 109.73,2.03 | L4.2 143.7,9.14 | 143.7,9.14 143.7,1.97 143.51,1.78
  Bottom 0.406: v113.28,10.92 113.28,11.68 v111.76,13.21
VMON1  (via drill 0.7)
  Top 0.254: 63.5,24.89 63.5,23.37
  Top 0.305: R26.P$2 46.99,14.22 48.26,15.49 48.26,18.54
  Top 0.406: IC2.P$6 IC2.P$5 161.12,12.11 v160.78,12.45 | v154.43,31.24 152.91,32.77 104.65,32.77 103.89,32 64.77,32 63.5,30.73 63.5,24.89 | 48.26,18.54 49.02,19.3 59.44,19.3 63.5,23.37
  Bottom 0.406: v160.78,12.45 160.78,12.95 JP8.2 155.45,19.3 154.43,20.32 v154.43,31.24
VMON1_B  (1 unrouted)
  Top 0.406: R27.P$2 R26.P$1 41.91,13.54 U$1.A10
VMON2_B
  Top 0.406: R25.P$2 R24.P$1 47.31,6.67 U$1.19/A5
VMON3_B
  Top 0.406: R23.P$2 R22.P$1 53.91,8.19 U$1.17/A3
VMON4_B
  Top 0.406: R21.P$2 R20.P$1 60.26,8.32 U$1.15/A1
VSET1  (via drill 0.7)  (2 unrouted)
  Top 0.305: 75.95,6.1 74.82,6.1 IC3.1
  Top 0.406: 108.46,10.09 108.46,8.64 106.05,6.22 106.05,5.84 104.46,7.43 | R14.2 v143.26,11.94 | v104.14,12.45 104.14,7.75 104.46,7.43 | v76.45,3.3 76.45,5.59 75.95,6.1 | v104.39,3.3 104.39,7.37 104.46,7.43
  Bottom 0.406: v143.26,11.94 133.1,11.94 132.59,12.45 118.87,12.45 116.59,14.73 106.43,14.73 v104.14,12.45 | v104.39,3.3 v76.45,3.3
VSS
  Top 1.676: LP2.P$2 182.81,2.57 CP5.+ 182.02,2.39 175.01,9.4 U1.P$14